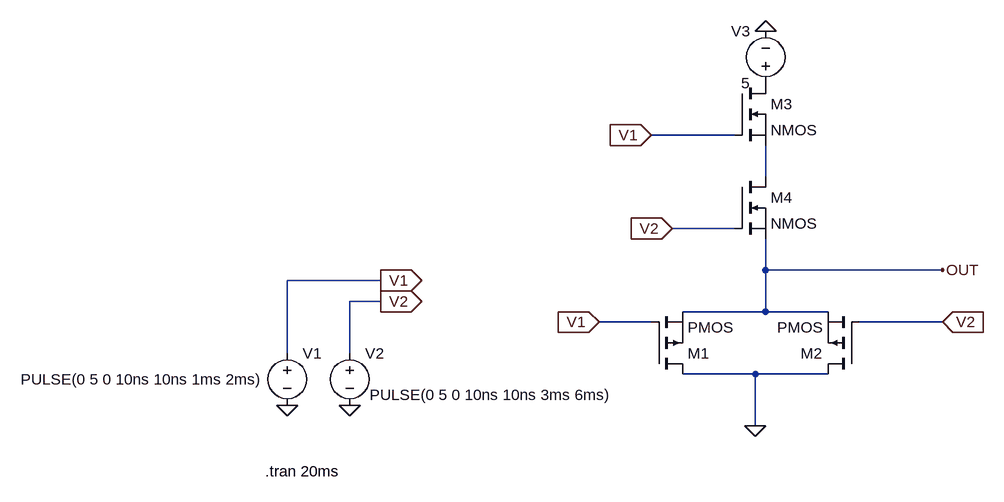
[diagram p0: schematic and_gate.asc]
and_gate.asc, the LTspice schematic file:
Version 4
SHEET 1 1112 680
WIRE 704 -144 576 -144
WIRE 752 -80 752 -128
WIRE 704 0 608 0
WIRE 752 64 752 16
WIRE 1024 64 752 64
WIRE 160 80 16 80
WIRE 160 112 112 112
WIRE 752 128 752 64
WIRE 752 128 624 128
WIRE 848 128 752 128
WIRE 576 144 496 144
WIRE 1024 144 896 144
WIRE 16 192 16 80
WIRE 112 192 112 112
WIRE 736 224 624 224
WIRE 848 224 736 224
WIRE 736 304 736 224
FLAG 16 272 0
FLAG 112 272 0
FLAG 736 304 0
FLAG 752 -304 0
FLAG 1024 64 OUT
FLAG 160 80 V1
IOPIN 160 80 Out
FLAG 496 144 V1
IOPIN 496 144 In
FLAG 1024 144 V2
IOPIN 1024 144 In
FLAG 608 0 V2
IOPIN 608 0 In
FLAG 576 -144 V1
IOPIN 576 -144 In
FLAG 160 112 V2
IOPIN 160 112 Out
SYMBOL voltage 16 176 R0
WINDOW 3 -410 56 Left 2
WINDOW 123 0 0 Left 0
WINDOW 39 0 0 Left 0
SYMATTR InstName V1
SYMATTR Value PULSE(0 5 0 10ns 10ns 1ms 2ms)
SYMBOL voltage 112 176 R0
WINDOW 3 31 80 Left 2
WINDOW 123 0 0 Left 0
WINDOW 39 0 0 Left 0
SYMATTR InstName V2
SYMATTR Value PULSE(0 5 0 10ns 10ns 3ms 6ms)
SYMBOL pmos 576 224 M180
SYMATTR InstName M1
SYMBOL pmos 896 224 R180
SYMATTR InstName M2
SYMBOL nmos 704 -224 R0
SYMATTR InstName M3
SYMBOL nmos 704 -80 R0
SYMATTR InstName M4
SYMBOL voltage 752 -208 R180
WINDOW 0 24 96 Left 2
WINDOW 3 24 16 Left 2
WINDOW 123 0 0 Left 0
WINDOW 39 0 0 Left 0
SYMATTR InstName V3
SYMATTR Value 5
TEXT -18 374 Left 2 !.tran 20ms

The netlist it stands for:
* and_gate.asc
V1 V1 0 PULSE(0 5 0 10ns 10ns 1ms 2ms)
V2 V2 0 PULSE(0 5 0 10ns 10ns 3ms 6ms)
M1 0 V1 OUT OUT PMOS
M2 0 V2 OUT OUT PMOS
M3 P001 V1 N001 N001 NMOS
M4 N001 V2 OUT OUT NMOS
V3 P001 0 5
.model NMOS NMOS
.model PMOS PMOS
.lib standard.mos
.tran 20ms
.backanno
.end